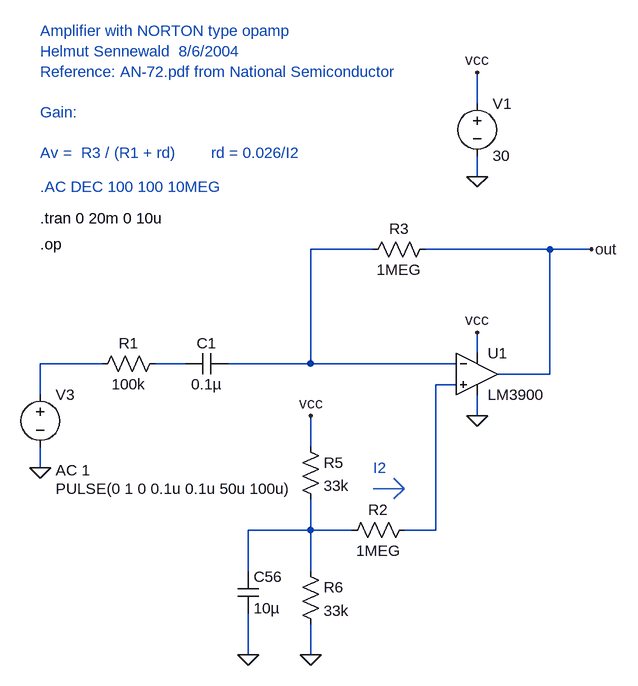
[diagram p0: schematic LM3900_x10.asc]
LM3900_x10.asc, the LTspice schematic file:
Version 4
SHEET 1 2576 884
WIRE -624 -64 -432 -64
WIRE -704 -64 -800 -64
WIRE -544 -208 -544 -176
WIRE -544 -288 -544 -336
WIRE -656 368 -608 368
WIRE -736 368 -800 368
WIRE -800 368 -800 432
WIRE -800 512 -800 560
WIRE -1216 240 -1216 272
WIRE -1216 160 -1216 112
WIRE -1216 112 -1120 112
WIRE -1040 112 -992 112
WIRE -928 112 -800 112
WIRE -544 96 -544 64
WIRE -544 160 -544 192
WIRE -512 128 -432 128
WIRE -432 128 -432 -64
WIRE -432 -64 -368 -64
WIRE -608 368 -608 144
WIRE -608 144 -576 144
WIRE -800 -64 -800 112
WIRE -800 112 -576 112
WIRE -800 320 -800 368
WIRE -800 240 -800 192
WIRE -800 368 -896 368
WIRE -896 368 -896 432
WIRE -896 496 -896 560
FLAG -368 -64 out
FLAG -544 -176 0
FLAG -544 -336 vcc
FLAG -544 192 0
FLAG -544 64 vcc
FLAG -800 560 0
FLAG -1216 272 0
FLAG -800 192 vcc
FLAG -896 560 0
SYMBOL res -720 -48 R270
WINDOW 0 32 56 VTop 0
WINDOW 3 0 56 VBottom 0
SYMATTR InstName R3
SYMATTR Value 1MEG
SYMBOL voltage -544 -304 R0
SYMATTR InstName V1
SYMATTR Value 30
SYMBOL res -1136 128 R270
WINDOW 0 32 56 VTop 0
WINDOW 3 0 56 VBottom 0
SYMATTR InstName R1
SYMATTR Value 100k
SYMBOL res -752 384 R270
WINDOW 0 32 56 VTop 0
WINDOW 3 0 56 VBottom 0
SYMATTR InstName R2
SYMATTR Value 1MEG
SYMBOL voltage -1216 144 R0
WINDOW 3 24 160 Left 0
WINDOW 123 24 132 Left 0
WINDOW 39 0 0 Left 0
SYMATTR Value PULSE(0 1 0 0.1u 0.1u 50u 100u)
SYMATTR Value2 AC 1
SYMATTR InstName V3
SYMBOL cap -992 128 R270
WINDOW 0 32 32 VTop 0
WINDOW 3 0 32 VBottom 0
SYMATTR InstName C1
SYMATTR Value 0.1µ
SYMBOL D:\\WUTemp\\LM3900\\LM3900 -544 64 R0
SYMATTR InstName U1
SYMBOL res -816 224 R0
SYMATTR InstName R5
SYMATTR Value 33k
SYMBOL res -816 416 R0
SYMATTR InstName R6
SYMATTR Value 33k
SYMBOL cap -912 432 R0
SYMATTR InstName C56
SYMATTR Value 10µ
TEXT -1216 -72 Left 0 !.op
TEXT -1216 -160 Left 0 ;.AC DEC 100 100 10MEG
TEXT -1216 -112 Left 0 !.tran 0 20m 0 10u
TEXT -1216 -400 Left 0 ;Amplifier with NORTON type opamp\nHelmut Sennewald  8/6/2004\nReference: AN-72.pdf from National Semiconductor\n \nGain:\n \nAv =  R3 / (R1 + rd)        rd = 0.026/I2
TEXT -704 272 Left 0 ;I2
LINE Normal -656 304 -704 304
LINE Normal -672 288 -656 304
LINE Normal -672 320 -656 304

The netlist it stands for:
* LM3900_x10.asc
R3 N001 out 1MEG
V1 vcc 0 30
R1 N004 N005 100k
R2 N003 N002 1MEG
V3 N004 0 PULSE(0 1 0 0.1u 0.1u 50u 100u) AC 1
C1 N005 N001 0.1µ
* U1: LM3900 (symbol D:\WUTemp\LM3900\LM3900 not available, pins judged from their places): In+=N002 In-=N001 V+=vcc V-=0 OUT=out
R5 vcc N003 33k
R6 N003 0 33k
C56 N003 0 10µ
.op
* .AC DEC 100 100 10MEG
.tran 0 20m 0 10u
* Amplifier with NORTON type opamp
* Helmut Sennewald  8/6/2004
* Reference: AN-72.pdf from National Semiconductor
* Gain:
* Av =  R3 / (R1 + rd)        rd = 0.026/I2
* I2
.backanno
.end